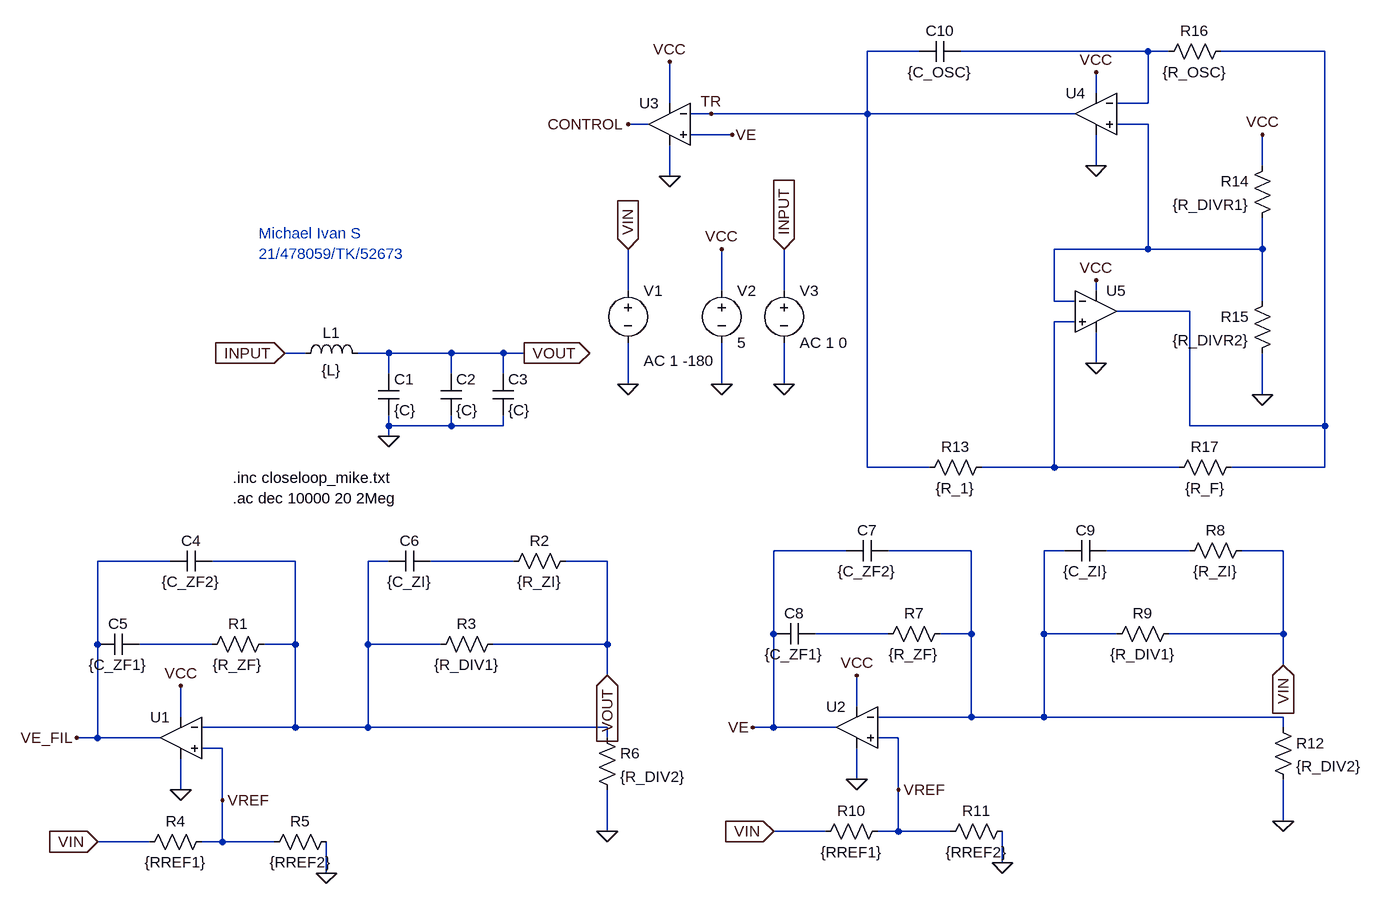
[diagram p0: schematic feedback_mike.asc]
feedback_mike.asc, the LTspice schematic file:
Version 4
SHEET 1 1532 904
WIRE 832 -384 752 -384
WIRE 1184 -384 896 -384
WIRE 1216 -384 1184 -384
WIRE 1456 -384 1296 -384
WIRE 1104 -320 1104 -352
WIRE 448 -304 448 -368
WIRE 1184 -304 1184 -384
WIRE 1184 -304 1136 -304
WIRE 512 -288 480 -288
WIRE 752 -288 752 -384
WIRE 752 -288 512 -288
WIRE 1072 -288 752 -288
WIRE 416 -272 384 -272
WIRE 1184 -272 1136 -272
WIRE 544 -256 480 -256
WIRE 1104 -208 1104 -256
WIRE 1360 -208 1360 -256
WIRE 448 -192 448 -240
WIRE 1184 -80 1184 -272
WIRE 1184 -80 1040 -80
WIRE 1360 -80 1360 -128
WIRE 1360 -80 1184 -80
WIRE 384 -16 384 -80
WIRE 528 -16 528 -80
WIRE 624 -16 624 -80
WIRE 1104 -16 1104 -32
WIRE 1040 0 1040 -80
WIRE 1072 0 1040 0
WIRE 1360 0 1360 -80
WIRE 1248 16 1136 16
WIRE 1072 32 1040 32
WIRE -112 80 -144 80
WIRE 16 80 -32 80
WIRE 112 80 16 80
WIRE 192 80 112 80
WIRE 224 80 192 80
WIRE 1104 96 1104 48
WIRE 16 112 16 80
WIRE 112 112 112 80
WIRE 192 112 192 80
WIRE 384 128 384 64
WIRE 528 128 528 64
WIRE 624 128 624 64
WIRE 1360 144 1360 80
WIRE 16 192 16 176
WIRE 112 192 112 176
WIRE 112 192 16 192
WIRE 192 192 192 176
WIRE 192 192 112 192
WIRE 1248 192 1248 16
WIRE 1456 192 1456 -384
WIRE 1456 192 1248 192
WIRE 16 208 16 192
WIRE 752 256 752 -288
WIRE 848 256 752 256
WIRE 1040 256 1040 32
WIRE 1040 256 928 256
WIRE 1232 256 1040 256
WIRE 1456 256 1456 192
WIRE 1456 256 1312 256
WIRE 720 384 608 384
WIRE 912 384 784 384
WIRE 1056 384 1024 384
WIRE 1248 384 1120 384
WIRE 1392 384 1328 384
WIRE -320 400 -432 400
WIRE -128 400 -256 400
WIRE 16 400 -16 400
WIRE 208 400 80 400
WIRE 352 400 288 400
WIRE 608 512 608 384
WIRE 784 512 672 512
WIRE 912 512 912 384
WIRE 912 512 864 512
WIRE 1024 512 1024 384
WIRE 1136 512 1024 512
WIRE 1392 512 1392 384
WIRE 1392 512 1216 512
WIRE -432 528 -432 400
WIRE -256 528 -368 528
WIRE -128 528 -128 400
WIRE -128 528 -176 528
WIRE -16 528 -16 400
WIRE 96 528 -16 528
WIRE 352 528 352 400
WIRE 352 528 176 528
WIRE 1392 560 1392 512
WIRE 352 576 352 528
WIRE 736 624 736 576
WIRE -304 640 -304 592
WIRE 912 640 912 512
WIRE 912 640 768 640
WIRE 1024 640 1024 512
WIRE 1024 640 912 640
WIRE 1392 640 1024 640
WIRE -128 656 -128 528
WIRE -128 656 -272 656
WIRE -16 656 -16 528
WIRE -16 656 -128 656
WIRE 352 656 -16 656
WIRE 608 656 608 512
WIRE 608 656 576 656
WIRE 704 656 608 656
WIRE 1392 656 1392 640
WIRE -432 672 -432 528
WIRE -432 672 -464 672
WIRE -336 672 -432 672
WIRE 352 672 352 656
WIRE 800 672 768 672
WIRE -240 688 -272 688
WIRE 736 736 736 688
WIRE -304 752 -304 704
WIRE 800 752 800 672
WIRE -240 768 -240 688
WIRE 1392 800 1392 736
WIRE 352 816 352 752
WIRE 688 816 608 816
WIRE 800 816 800 752
WIRE 800 816 768 816
WIRE 880 816 800 816
WIRE -352 832 -432 832
WIRE -240 832 -240 768
WIRE -240 832 -272 832
WIRE -160 832 -240 832
WIRE 960 864 960 816
WIRE -80 880 -80 832
FLAG 16 208 0
FLAG 352 816 0
FLAG -80 880 0
FLAG -304 752 0
FLAG -304 592 VCC
FLAG -432 832 VIN
IOPIN -432 832 In
FLAG -464 672 VE_FIL
FLAG -240 768 VREF
FLAG 352 576 VOUT
IOPIN 352 576 In
FLAG 1392 800 0
FLAG 960 864 0
FLAG 736 736 0
FLAG 736 576 VCC
FLAG 608 816 VIN
IOPIN 608 816 In
FLAG 576 656 VE
FLAG 800 752 VREF
FLAG 1392 560 VIN
IOPIN 1392 560 In
FLAG 384 128 0
FLAG 1104 -208 0
FLAG 1104 96 0
FLAG 1360 144 0
FLAG 448 -192 0
FLAG 448 -368 VCC
FLAG 544 -256 VE
FLAG 384 -272 CONTROL
FLAG 1104 -352 VCC
FLAG 1104 -32 VCC
FLAG 1360 -256 VCC
FLAG 512 -288 TR
FLAG 528 128 0
FLAG 528 -80 VCC
FLAG 624 128 0
FLAG -144 80 INPUT
IOPIN -144 80 In
FLAG 224 80 VOUT
IOPIN 224 80 Out
FLAG 384 -80 VIN
IOPIN 384 -80 In
FLAG 624 -80 INPUT
IOPIN 624 -80 In
SYMBOL ind -128 96 R270
WINDOW 0 32 56 VTop 2
WINDOW 3 5 56 VBottom 2
SYMATTR InstName L1
SYMATTR Value {L}
SYMBOL cap 0 112 R0
SYMATTR InstName C1
SYMATTR Value {C}
SYMBOL cap 96 112 R0
SYMATTR InstName C2
SYMATTR Value {C}
SYMBOL cap 176 112 R0
SYMATTR InstName C3
SYMATTR Value {C}
SYMBOL cap -320 416 R270
WINDOW 0 32 32 VTop 2
WINDOW 3 0 32 VBottom 2
SYMATTR InstName C4
SYMATTR Value {C_ZF2}
SYMBOL cap -432 544 R270
WINDOW 0 32 32 VTop 2
WINDOW 3 0 32 VBottom 2
SYMATTR InstName C5
SYMATTR Value {C_ZF1}
SYMBOL res -272 544 R270
WINDOW 0 32 56 VTop 2
WINDOW 3 0 56 VBottom 2
SYMATTR InstName R1
SYMATTR Value {R_ZF}
SYMBOL cap 16 416 R270
WINDOW 0 32 32 VTop 2
WINDOW 3 0 32 VBottom 2
SYMATTR InstName C6
SYMATTR Value {C_ZI}
SYMBOL res 192 416 R270
WINDOW 0 32 56 VTop 2
WINDOW 3 0 56 VBottom 2
SYMATTR InstName R2
SYMATTR Value {R_ZI}
SYMBOL res 80 544 R270
WINDOW 0 32 56 VTop 2
WINDOW 3 0 56 VBottom 2
SYMATTR InstName R3
SYMATTR Value {R_DIV1}
SYMBOL res -368 848 R270
WINDOW 0 32 56 VTop 2
WINDOW 3 0 56 VBottom 2
SYMATTR InstName R4
SYMATTR Value {RREF1}
SYMBOL res -176 848 R270
WINDOW 0 32 56 VTop 2
WINDOW 3 0 56 VBottom 2
SYMATTR InstName R5
SYMATTR Value {RREF2}
SYMBOL res 336 656 R0
SYMATTR InstName R6
SYMATTR Value {R_DIV2}
SYMBOL OpAmps\\UniversalOpAmp2 -304 672 M0
SYMATTR InstName U1
SYMBOL cap 720 400 R270
WINDOW 0 32 32 VTop 2
WINDOW 3 0 32 VBottom 2
SYMATTR InstName C7
SYMATTR Value {C_ZF2}
SYMBOL cap 608 528 R270
WINDOW 0 32 32 VTop 2
WINDOW 3 0 32 VBottom 2
SYMATTR InstName C8
SYMATTR Value {C_ZF1}
SYMBOL res 768 528 R270
WINDOW 0 32 56 VTop 2
WINDOW 3 0 56 VBottom 2
SYMATTR InstName R7
SYMATTR Value {R_ZF}
SYMBOL cap 1056 400 R270
WINDOW 0 32 32 VTop 2
WINDOW 3 0 32 VBottom 2
SYMATTR InstName C9
SYMATTR Value {C_ZI}
SYMBOL res 1232 400 R270
WINDOW 0 32 56 VTop 2
WINDOW 3 0 56 VBottom 2
SYMATTR InstName R8
SYMATTR Value {R_ZI}
SYMBOL res 1120 528 R270
WINDOW 0 32 56 VTop 2
WINDOW 3 0 56 VBottom 2
SYMATTR InstName R9
SYMATTR Value {R_DIV1}
SYMBOL res 672 832 R270
WINDOW 0 32 56 VTop 2
WINDOW 3 0 56 VBottom 2
SYMATTR InstName R10
SYMATTR Value {RREF1}
SYMBOL res 864 832 R270
WINDOW 0 32 56 VTop 2
WINDOW 3 0 56 VBottom 2
SYMATTR InstName R11
SYMATTR Value {RREF2}
SYMBOL res 1376 640 R0
SYMATTR InstName R12
SYMATTR Value {R_DIV2}
SYMBOL OpAmps\\UniversalOpAmp2 736 656 M0
SYMATTR InstName U2
SYMBOL OpAmps\\UniversalOpAmp2 448 -272 M0
SYMATTR InstName U3
SYMBOL OpAmps\\UniversalOpAmp2 1104 -288 M0
SYMATTR InstName U4
SYMBOL OpAmps\\UniversalOpAmp2 1104 16 R0
SYMATTR InstName U5
SYMBOL cap 832 -368 R270
WINDOW 0 32 32 VTop 2
WINDOW 3 0 32 VBottom 2
SYMATTR InstName C10
SYMATTR Value {C_OSC}
SYMBOL res 832 272 R270
WINDOW 0 32 56 VTop 2
WINDOW 3 0 56 VBottom 2
SYMATTR InstName R13
SYMATTR Value {R_1}
SYMBOL res 1376 -224 M0
SYMATTR InstName R14
SYMATTR Value {R_DIVR1}
SYMBOL res 1376 -16 M0
SYMATTR InstName R15
SYMATTR Value {R_DIVR2}
SYMBOL res 1200 -368 R270
WINDOW 0 32 56 VTop 2
WINDOW 3 0 56 VBottom 2
SYMATTR InstName R16
SYMATTR Value {R_OSC}
SYMBOL res 1216 272 R270
WINDOW 0 32 56 VTop 2
WINDOW 3 0 56 VBottom 2
SYMATTR InstName R17
SYMATTR Value {R_F}
SYMBOL voltage 384 -32 R0
WINDOW 123 24 124 Left 2
WINDOW 39 0 0 Left 0
SYMATTR InstName V1
SYMATTR Value ""
SYMATTR Value2 AC 1 -180
SYMBOL voltage 528 -32 R0
SYMATTR InstName V2
SYMATTR Value 5
SYMBOL voltage 624 -32 R0
SYMATTR InstName V3
SYMATTR Value AC 1 0
TEXT -224 272 Left 2 !.inc closeloop_mike.txt\n.ac dec 10000 20 2Meg
TEXT -184 -104 Left 2 ;Michael Ivan S\n21/478059/TK/52673

The netlist it stands for:
* feedback_mike.asc
L1 INPUT VOUT {L}
C1 VOUT 0 {C}
C2 VOUT 0 {C}
C3 VOUT 0 {C}
C4 VE_FIL N007 {C_ZF2}
C5 VE_FIL N010 {C_ZF1}
R1 N010 N007 {R_ZF}
C6 N007 N008 {C_ZI}
R2 N008 VOUT {R_ZI}
R3 N007 VOUT {R_DIV1}
R4 VIN VREF {RREF1}
R5 VREF 0 {RREF2}
R6 N007 0 {R_DIV2}
XU1 VREF N007 VCC 0 VE_FIL level2 Avol=1Meg GBW=10Meg Slew=10Meg Ilimit=25m Rail=0 Vos=0 En=0 Enk=0 In=0 Ink=0 Rin=500Meg  ; pins In+ In- V+ V- OUT
C7 VE N005 {C_ZF2}
C8 VE N009 {C_ZF1}
R7 N009 N005 {R_ZF}
C9 N005 N006 {C_ZI}
R8 N006 VIN {R_ZI}
R9 N005 VIN {R_DIV1}
R10 VIN VREF {RREF1}
R11 VREF 0 {RREF2}
R12 N005 0 {R_DIV2}
XU2 VREF N005 VCC 0 VE level2 Avol=1Meg GBW=10Meg Slew=10Meg Ilimit=25m Rail=0 Vos=0 En=0 Enk=0 In=0 Ink=0 Rin=500Meg  ; pins In+ In- V+ V- OUT
XU3 VE TR VCC 0 CONTROL level2 Avol=1Meg GBW=10Meg Slew=10Meg Ilimit=25m Rail=0 Vos=0 En=0 Enk=0 In=0 Ink=0 Rin=500Meg  ; pins In+ In- V+ V- OUT
XU4 N003 N001 VCC 0 TR level2 Avol=1Meg GBW=10Meg Slew=10Meg Ilimit=25m Rail=0 Vos=0 En=0 Enk=0 In=0 Ink=0 Rin=500Meg  ; pins In+ In- V+ V- OUT
XU5 N004 N003 VCC 0 N002 level2 Avol=1Meg GBW=10Meg Slew=10Meg Ilimit=25m Rail=0 Vos=0 En=0 Enk=0 In=0 Ink=0 Rin=500Meg  ; pins In+ In- V+ V- OUT
C10 TR N001 {C_OSC}
R13 TR N004 {R_1}
R14 VCC N003 {R_DIVR1}
R15 N003 0 {R_DIVR2}
R16 N001 N002 {R_OSC}
R17 N004 N002 {R_F}
V1 VIN 0 AC 1 -180
V2 VCC 0 5
V3 INPUT 0 AC 1 0
.inc closeloop_mike.txt
.ac dec 10000 20 2Meg
* Michael Ivan S
* 21/478059/TK/52673
.lib UniversalOpAmp2.lib
.backanno
.end